# Altium schematic sheet top_dsn.SchDoc
size A4; Date: 1/11/16; Engineer: JBayalas; DocumentNumber: 3; Revision: V4.3.0; SheetNumber: 3; SheetTotal: 12
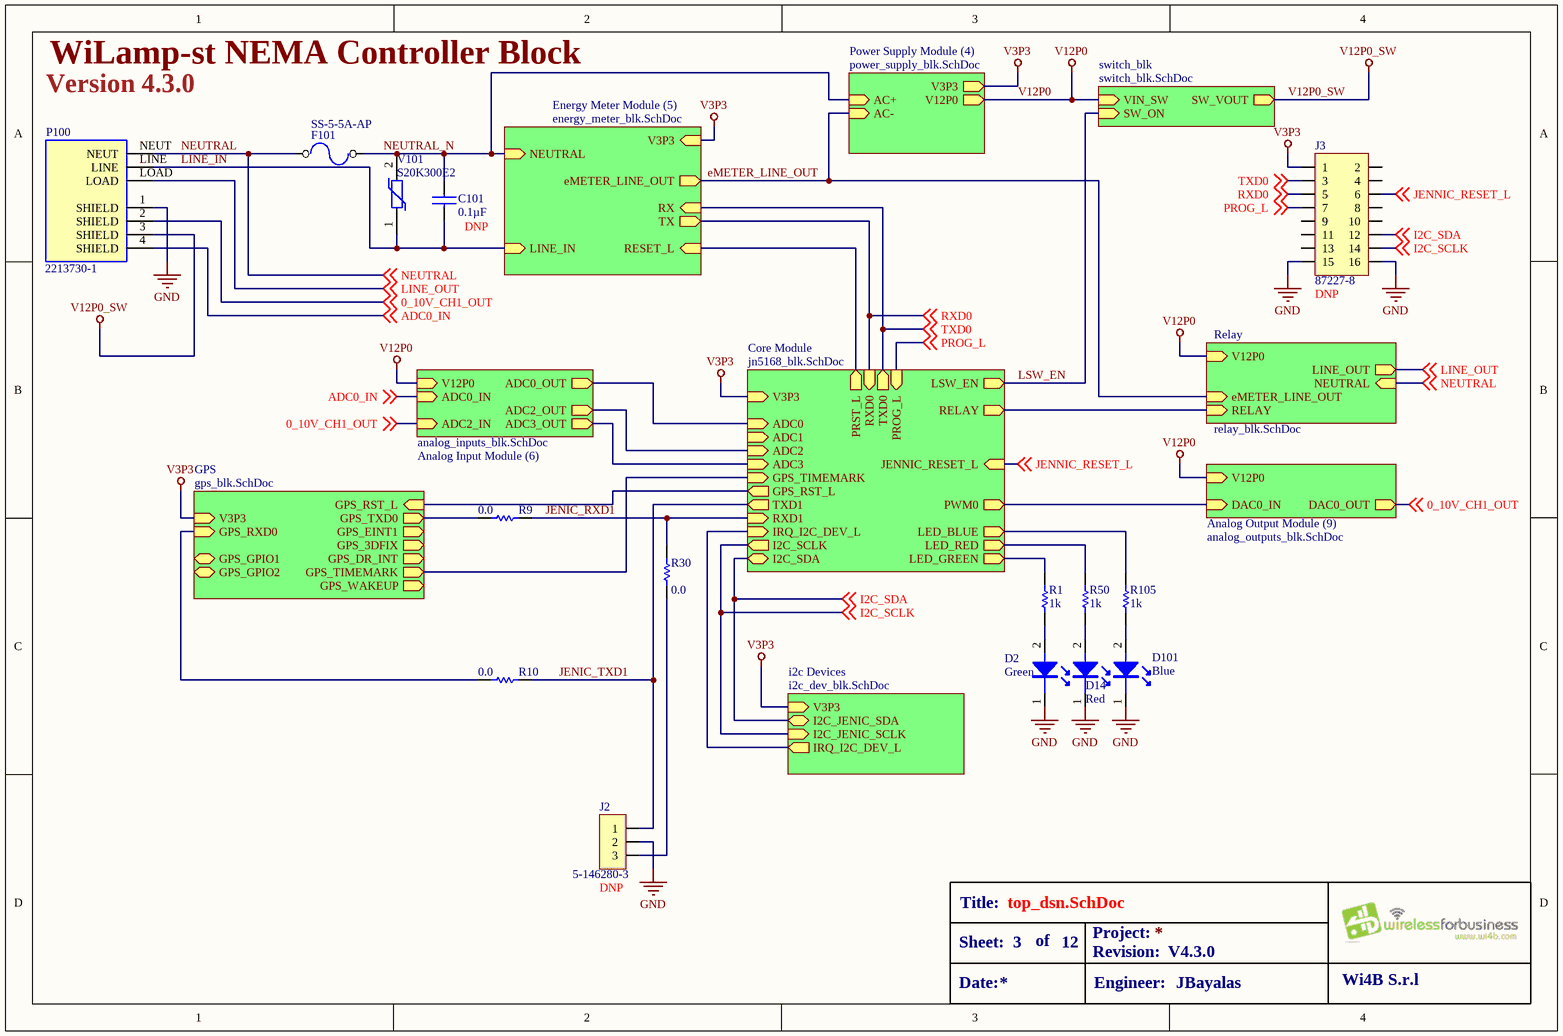
[diagram p0: top_dsn.SchDoc]

## Parts
C101  value 0.1µF  [R46KF310000P1M]  (hidden comment: R46KF310000P1M)
D2  value Green  [LED0402(GREEN)]  (hidden comment: XZVGR68W-3)
D14  value Red  [LED0402(RED)]  (hidden comment: VLMS1500-GS08)
D101  value Blue  [LED0402(BLUE)]  (hidden comment: VLMB1500-GS08)
F101  SS-5-5A-AP  [SS-5-5A-AP]
J2  5-146280-3  [5-146280-3]
J3  87227-8  [87227-8]
P100  2213730-1  [LIGHTCTRL_2213730-1_2213730-1(Primary)]
R1  value 1k  [R0402]  (hidden comment: ERJ-2RKF1001X)
R9  value 0.0  [R0603]  (hidden comment: CRCW06030000Z0EA)
R10  value 0.0  [R0603]  (hidden comment: CRCW06030000Z0EA)
R30  value 0.0  [R0603]  (hidden comment: CRCW06030000Z0EA)
R50  value 1k  [R0402]  (hidden comment: ERJ-2RKF1001X)
R105  value 1k  [R0402]  (hidden comment: ERJ-2RKF1001X)
V101  S20K300E2  [S20K300E2]

## Sub-sheets
Analog Input Module (6) = analog_inputs_blk.SchDoc: ADC0_OUT (out), ADC2_IN (in), ADC2_OUT (out), ADC0_IN (in), V12P0 (in), ADC3_OUT (out)
Analog Output Module (9) = analog_outputs_blk.SchDoc: DAC0_OUT (out), DAC0_IN (in), V12P0 (in)
Core Module = jn5168_blk.SchDoc: V3P3 (in), ADC0 (in), PROG_L (in), ADC1 (in), ADC2 (in), TXD0 (out), RXD0 (in), TXD1 (out), RXD1 (in), PWM0 (out), LED_BLUE (out), RELAY (out), PRST_L (out), I2C_SDA (bidir), I2C_SCLK (out), ADC3 (in), LED_RED (out), IRQ_I2C_DEV_L (in), LED_GREEN (out), GPS_RST_L (out), LSW_EN (out), GPS_TIMEMARK (in), JENNIC_RESET_L (in)
Energy Meter Module (5) = energy_meter_blk.SchDoc: LINE_IN (in), NEUTRAL (in), eMETER_LINE_OUT (out), TX (out), RX (in), RESET_L (in), V3P3 (in)
GPS = gps_blk.SchDoc: V3P3 (in), GPS_TXD0 (out), GPS_RXD0 (in), GPS_RST_L (in), GPS_GPIO1 (bidir), GPS_GPIO2 (bidir), GPS_EINT1 (out), GPS_3DFIX (out), GPS_DR_INT (out), GPS_TIMEMARK (out), GPS_WAKEUP (out)
i2c Devices = i2c_dev_blk.SchDoc: I2C_JENIC_SDA (bidir), I2C_JENIC_SCLK (in), V3P3 (in), IRQ_I2C_DEV_L (out)
Power Supply Module (4) = power_supply_blk.SchDoc: V12P0 (out), AC+ (in), AC- (in), V3P3 (out)
Relay = relay_blk.SchDoc: V12P0 (in), RELAY (in), eMETER_LINE_OUT (in), LINE_OUT (out), NEUTRAL (in)
switch_blk = switch_blk.SchDoc: VIN_SW (in), SW_ON (in), SW_VOUT (out)

## Nets
GND: D2.1 D14.1 D101.1 J2.2 J3.15 J3.16 P100.1(SHIELD)
V3P3: J3.1 ; sheet Power Supply Module (4)/V3P3, sheet Energy Meter Module (5)/V3P3, sheet Core Module/V3P3, sheet i2c Devices/V3P3, sheet GPS/V3P3
V12P0: sheet Power Supply Module (4)/V12P0, sheet Analog Input Module (6)/V12P0, sheet Analog Output Module (9)/V12P0, sheet Relay/V12P0, sheet switch_blk/VIN_SW
V12P0_SW: P100.3(SHIELD) ; sheet switch_blk/SW_VOUT
0_10V_CH1_OUT: P100.2(SHIELD) ; off-sheet 0_10V_CH1_OUT, sheet Analog Input Module (6)/ADC2_IN, sheet Analog Output Module (9)/DAC0_OUT
ADC0_IN: P100.4(SHIELD) ; off-sheet ADC0_IN, sheet Analog Input Module (6)/ADC0_IN
eMETER_LINE_OUT: sheet Power Supply Module (4)/AC-, sheet Energy Meter Module (5)/eMETER_LINE_OUT, sheet Relay/eMETER_LINE_OUT
I2C_SCLK: J3.14 ; off-sheet I2C_SCLK, sheet Core Module/I2C_SCLK, sheet i2c Devices/I2C_JENIC_SCLK
I2C_SDA: J3.12 ; off-sheet I2C_SDA, sheet Core Module/I2C_SDA, sheet i2c Devices/I2C_JENIC_SDA
JENIC_RXD1: R9.1 R30.2 ; sheet Core Module/RXD1
JENIC_TXD1: J2.1 R10.1 ; sheet Core Module/TXD1
JENNIC_RESET_L: J3.6 ; off-sheet JENNIC_RESET_L, sheet Core Module/JENNIC_RESET_L
LINE_IN: C101.2 P100.LINE V101.1 ; sheet Energy Meter Module (5)/LINE_IN
LINE_OUT: P100.LOAD ; off-sheet LINE_OUT, sheet Relay/LINE_OUT
LSW_EN: sheet Core Module/LSW_EN, sheet switch_blk/SW_ON
NEUTRAL: F101.1 P100.NEUT ; off-sheet NEUTRAL, sheet Relay/NEUTRAL
NEUTRAL_N: C101.1 F101.2 V101.2 ; sheet Power Supply Module (4)/AC+, sheet Energy Meter Module (5)/NEUTRAL
PROG_L: J3.7 ; off-sheet PROG_L, sheet Core Module/PROG_L
RXD0: J3.5 ; off-sheet RXD0, sheet Energy Meter Module (5)/TX, sheet Core Module/RXD0
TXD0: J3.3 ; off-sheet TXD0, sheet Energy Meter Module (5)/RX, sheet Core Module/TXD0
NetD2_2: D2.2 R1.1
NetD14_2: D14.2 R50.1
NetD101_2: D101.2 R105.1
NetJ2_3: J2.3 R30.1
NetR1_2: R1.2 ; sheet Core Module/LED_GREEN
NetR9_2: R9.2 ; sheet GPS/GPS_TXD0
NetR10_2: R10.2 ; sheet GPS/GPS_RXD0
NetR50_2: R50.2 ; sheet Core Module/LED_RED
NetR105_2: R105.2 ; sheet Core Module/LED_BLUE
(unnamed): sheet Energy Meter Module (5)/RESET_L, sheet Core Module/PRST_L
(unnamed): sheet Analog Input Module (6)/ADC0_OUT, sheet Core Module/ADC0
(unnamed): sheet Analog Input Module (6)/ADC2_OUT, sheet Core Module/ADC2
(unnamed): sheet Analog Input Module (6)/ADC3_OUT, sheet Core Module/ADC3
(unnamed): sheet Analog Output Module (9)/DAC0_IN, sheet Core Module/PWM0
(unnamed): sheet Core Module/RELAY, sheet Relay/RELAY
(unnamed): sheet Core Module/IRQ_I2C_DEV_L, sheet i2c Devices/IRQ_I2C_DEV_L
(unnamed): sheet Core Module/GPS_RST_L, sheet GPS/GPS_RST_L
(unnamed): sheet Core Module/GPS_TIMEMARK, sheet GPS/GPS_TIMEMARK

Not connected (* = marked no-connect by the designer): J3 2 4 8 9 10 11 13

## Notes on the sheet
- Version 4.3.0
- WiLamp-st NEMA Controller Block
- Title:
- Sheet:
- Date:
- of
- Project:
- Revision:
- Engineer:
- Wi4B S.r.l

## Library data of the parts
C101 = R46KF310000P1M: CAP FILM 0.1UF 20% 560VDC RADIAL; MFT: Kemet; TYPE: Through Hole; FUNCTION: Top; MPN: R46KF310000P1M; RATING: 560VDC; DNP: DNP
D2 = XZVGR68W-3: LED GREEN CLEAR 0402 SMD; MFT: SunLED; FUNCTION: Top; MPN: XZVGR68W-3; TYPE: SMD; LOAD: *; RATING: *; APN: *
D14 = VLMS1500-GS08: LED RED 0402 SMD; ALT MPN1: YLS0402/R/21/05 C; MFT: Vishay Semiconductor Opto Division; ALT MFT1: Y.Lin Elect.; FUNCTION: Top; MPN: VLMS1500-GS08; TYPE: SMD; RATING: *; LOAD: *; ALT DESC1: *
D101 = VLMB1500-GS08: LED BLUE 0402 SMD; ALT MPN1: YLS0402/B/21/05 C; MFT: Vishay Semiconductor Opto Division; ALT MFT1: Y.Lin Elect; FUNCTION: Top; MPN: VLMB1500-GS08; TYPE: SMD; RATING: *; LOAD: *; ALT DESC1: *
F101 = SS-5-5A-AP: FUSE BOARD MOUNT 5A 250VAC RAD; MFT: Eaton Bussmann; TYPE: Through-Hole; FUNCTION: Top; VALUE: 5A; MPN: SS-5-5A-AP
J2 = 5-146280-3: CONN HEADR BRKWAY .100 3POS STR; MFT: TE Connectivity AMP Connectors; FUNCTION: Top; TYPE: TH; RATING: *; DNP: DNP; VALUE: 5-146280-3; MPN: 5-146280-3
J3 = 87227-8: CONN HEADER VERT .100 16POS 15AU; MFT: TE Connectivity AMP Connectors; FUNCTION: Top; VALUE: 87227-8; TYPE: SMD; RATING: *; DNP: DNP; MPN: 87227-8
P100 = 2213730-1: MFT: TE Connectivity; FUNCTION: Top; TYPE: TH; LOAD: *; RATING: *; VALUE: 2213730-1; MPN: 2213730-1
R1 R50 R105 = ERJ-2RKF1001X: RES SMD 1K OHM 1% 1/10W 0402; MFT: Panasonic Electronic Components; RATING: 0.1W, 1/10W; FUNCTION: Top; MPN: ERJ-2RKF1001X; TYPE: Surface Mount
R9 R10 R30 = CRCW06030000Z0EA: RES SMD 0.0OHM JUMPER 1/10W 0603; MFT: Vishay Dale; RATING: 0.1W, 1/10W; FUNCTION: Top; MPN: CRCW06030000Z0EA; DNP: *; TYPE: Surface Mount
V101 = S20K300E2: VARISTOR 470V 10KA DISC 20MM; ALT MPN1: SVR20D471KA99BH; MFT: EPCOS (TDK); ALT DESC1: 20D 470V 10KVA/5KVA 6000A(8/20us) Bulk SVR20D471KA99BH; ALT MFT1: Fenghua; FUNCTION: Top; VALUE: S20K300E2; TYPE: SMD; RATING: 470V 10KA; MPN: S20K300E2; LOAD: *; APN: *